# EAGLE design joulethief (EAGLE 6.4)
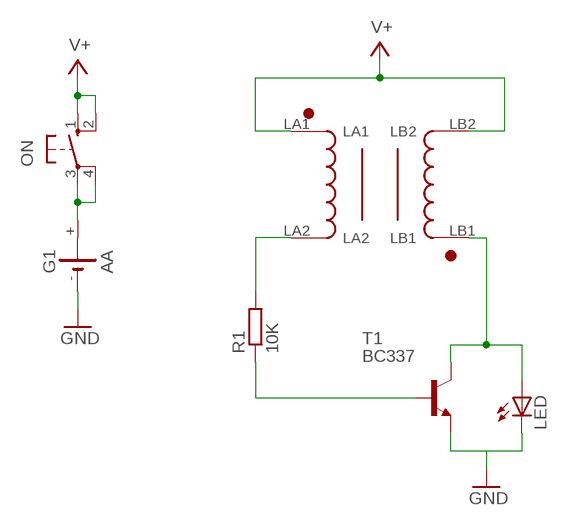
[diagram p0: schematic, sheet 1]

## Parts
G1  AA  [AA-HOLDER]
LED  LED5MM  [LED5MM]
ON  10-XX  [B3F-10XX]
R1  10K  R-EU_0207/10  [0207/10]
T1  BC337  [TO92]
U$1  COIL-BEAD  [BEAD-22-13.8-6.4]

## Nets
GND: G1.- LED.K(C) T1.1(E)
N$1: G1.+ ON.3(P) ON.4(P1)
N$2: R1.2 U$1.LA2
N$3: R1.1 T1.2(B)
N$5: LED.A T1.3(C) U$1.LB1
V+: ON.1(S) ON.2(S1) U$1.LA1 U$1.LB2

## Library data of the parts
G1 = tetalab:AA: AA Holder Eagle plastic devices
LED = led:LED: LED OSRAM: - CHIPLED LG R971, LG N971, LY N971, LG Q971, LY Q971, LO R971, LY R971 LH N974, LH R974 LS Q976, LO Q976, LY Q976 LO Q996 - Hyper CHIPLED LW Q18S LB Q993, LB Q99A, LB R99A - SideLED LS A670, LO A670, LY A670, LG A670, LP A670 LB A673, LV A673, LT A673, LW A673 LH A674 LY A675 LS A676, LA A676, LO A676, LY A676, LW A676 LS A679, LY A679, LG A679 - Hyper Micro SIDELED® LS Y876, LA Y876, LO Y876, LY Y876 LT Y87S - SmartLED LW L88C, LW L88S LB L89C, LB L89S, LG L890 LS L89K, LO L89K, LY L89K LS L896, LA L896, LO L896, LY L896 - TOPLED LS T670, LO T670, LY T670, LG T670, LP T670 LSG T670, LSP T670, LSY T670, LOP T670, LYG T670 LG T671, LOG T671, LSG T671 LB T673, LV T673, LT T673, LW T673 LH T674 LS T676, LA T676, LO T676, LY T676, LB T676, LH T676, LSB T676, LW T676 LB T67C, LV T67C, LT T67C, LS T67K, LO T67K, LY T67K, LW E67C LS E67B, LA E67B, LO E67B, LY E67B, LB E67C, LV E67C, LT E67C LW T67C LS T679, LY T679, LG T679 LS T770, LO T770, LY T770, LG T770, LP T770 LB T773, LV T773, LT T773, LW T773 LH T774 LS E675, LA E675, LY E675, LS T675 LS T776, LA T776, LO T776, LY T776, LB T776 LHGB T686 LT T68C, LB T68C - Hyper Mini TOPLED® LB M676 - Mini TOPLED Santana® LG M470 LS M47K, LO M47K, LY M47K Source: http://www.osram.convergy.de LUXEON: - LUMILED® LXK2-PW12-R00, LXK2-PW12-S00, LXK2-PW14-U00, LXK2-PW14-V00 LXK2-PM12-R00, LXK2-PM12-S00, LXK2-PM14-U00 LXK2-PE12-Q00, LXK2-PE12-R00, LXK2-PE12-S00, LXK2-PE14-T00, LXK2-PE14-U00 LXK2-PB12-K00, LXK2-PB12-L00, LXK2-PB12-M00, LXK2-PB14-N00, LXK2-PB14-P00, LXK2-PB14-Q00 LXK2-PR12-L00, LXK2-PR12-M00, LXK2-PR14-Q00, LXK2-PR14-R00 LXK2-PD12-Q00, LXK2-PD12-R00, LXK2-PD12-S00 LXK2-PH12-R00, LXK2-PH12-S00 LXK2-PL12-P00, LXK2-PL12-Q00, LXK2-PL12-R00 Source: www.luxeon.com KINGBRIGHT: KA-3528ASYC Source: www.kingbright.com
ON = switch-omron:10-XX: OMRON SWITCH; MPN: B3F-1000; OC_FARNELL: 176432; OC_NEWARK: 36M3542
R1 = rcl:R-EU_: RESISTOR, European symbol
T1 = transistor:BC337: NPN TRANSISTOR
U$1 = tetalab:COIL-BEAD

## Board
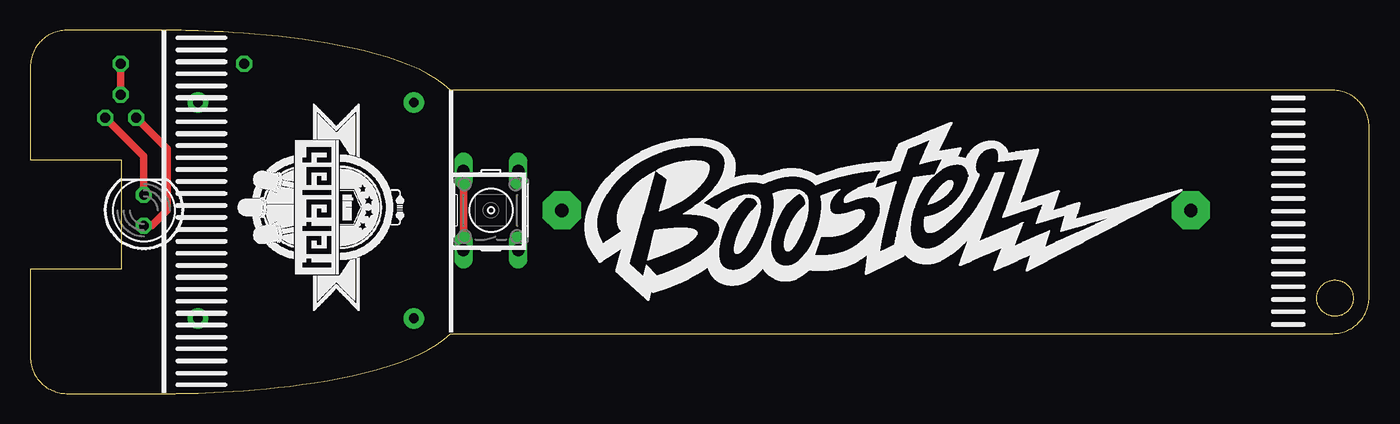
[diagram p1: board, top side]
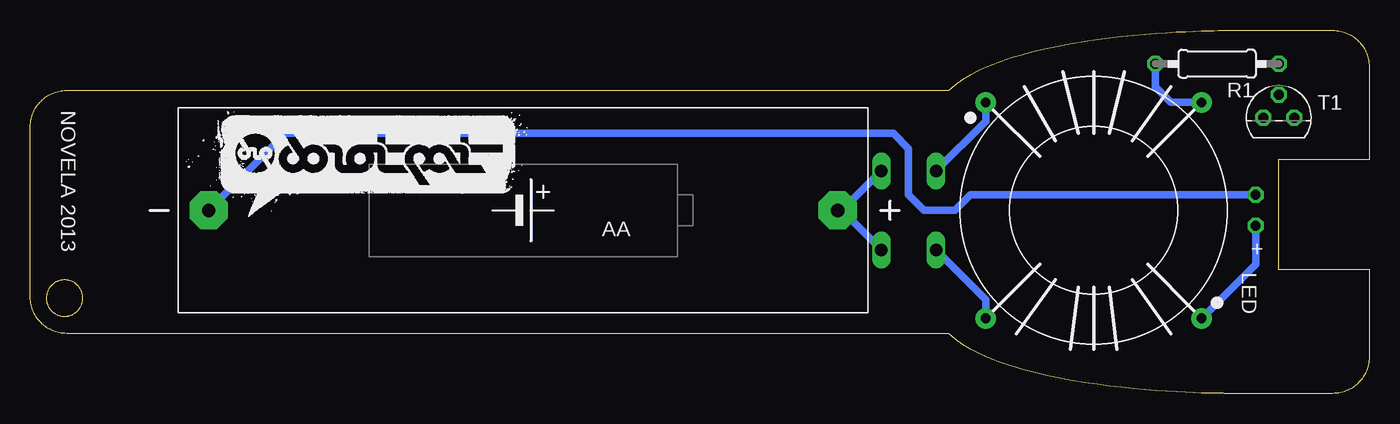
[diagram p2: board, bottom side, seen from below]

Size 110.26 x 29.9 mm. Coordinates in mm from the lower left corner, seen from the top.
Outline: 107.44,6.35 107.36,6.35 107.28,6.36 107.2,6.37 107.12,6.38 107.04,6.4 106.97,6.42 106.89,6.45 106.82,6.48 106.75,6.52 106.68,6.55 106.62,6.59 106.56,6.64 106.49,6.68 106.44,6.73 106.38,6.79 106.33,6.84 106.28,6.9 106.23,6.96 106.19,7.03 106.15,7.09 106.11,7.16 106.07,7.23 106.04,7.3 106.02,7.37 105.99,7.45 105.98,7.53 105.96,7.61 105.95,7.69 105.94,7.77 105.94,7.85 105.94,7.93 105.95,8.01 105.96,8.09 105.98,8.17 105.99,8.25 106.02,8.32 106.04,8.4 106.07,8.47 106.11,8.54 106.15,8.61 106.19,8.67 106.23,8.74 106.28,8.8 106.33,8.86 106.38,8.91 106.44,8.96 106.49,9.01 106.56,9.06 106.62,9.11 106.68,9.15 106.75,9.18 106.82,9.22 106.89,9.25 106.97,9.27 107.04,9.3 107.12,9.32 107.2,9.33 107.28,9.34 107.36,9.35 107.44,9.35 107.53,9.35 107.61,9.34 107.69,9.33 107.76,9.32 107.84,9.3 107.92,9.27 107.99,9.25 108.06,9.22 108.13,9.18 108.2,9.15 108.27,9.11 108.33,9.06 108.39,9.01 108.45,8.96 108.5,8.91 108.56,8.86 108.61,8.8 108.65,8.74 108.7,8.67 108.74,8.61 108.78,8.54 108.81,8.47 108.84,8.4 108.87,8.32 108.89,8.25 108.91,8.17 108.92,8.09 108.94,8.01 108.94,7.93 108.94,7.85 108.94,7.77 108.94,7.69 108.92,7.61 108.91,7.53 108.89,7.45 108.87,7.37 108.84,7.3 108.81,7.23 108.78,7.16 108.74,7.09 108.7,7.03 108.65,6.96 108.61,6.9 108.56,6.84 108.5,6.79 108.45,6.73 108.39,6.68 108.33,6.64 108.27,6.59 108.2,6.55 108.13,6.52 108.06,6.48 107.99,6.45 107.92,6.42 107.84,6.4 107.76,6.38 107.69,6.37 107.61,6.36 107.53,6.35 107.44,6.35
Outline: 34.63,24.96 34.08,25.44 33.45,25.88 32.76,26.3 32,26.68 31.19,27.04 30.32,27.37 29.42,27.67 28.47,27.95 27.49,28.2 26.5,28.43 25.48,28.64 24.45,28.83 23.43,29 22.4,29.15 21.39,29.28 20.39,29.39 19.41,29.49 18.47,29.58 17.56,29.65 16.7,29.71 15.88,29.76 15.13,29.8 14.44,29.83 13.81,29.86 13.27,29.87 12.81,29.88 12.44,29.89 12.17,29.9 12,29.9 11.94,29.9 3,29.9 2.84,29.89 2.68,29.88 2.52,29.86 2.36,29.83 2.21,29.79 2.06,29.74 1.91,29.69 1.77,29.63 1.63,29.56 1.49,29.49 1.36,29.4 1.23,29.32 1.11,29.22 0.99,29.12 0.88,29.01 0.78,28.9 0.68,28.79 0.58,28.66 0.49,28.54 0.41,28.41 0.34,28.27 0.27,28.13 0.21,27.99 0.15,27.84 0.11,27.69 0.07,27.54 0.04,27.38 0.02,27.22 0,27.06 0,26.89 0,19.23 7.47,19.23 7.47,10.22 0,10.22 0,3 0,2.84 0.02,2.68 0.04,2.52 0.07,2.36 0.11,2.21 0.15,2.06 0.21,1.91 0.27,1.77 0.34,1.63 0.41,1.49 0.49,1.36 0.58,1.23 0.68,1.11 0.78,0.99 0.88,0.88 0.99,0.78 1.11,0.68 1.23,0.58 1.36,0.49 1.49,0.41 1.63,0.34 1.77,0.27 1.91,0.21 2.06,0.15 2.21,0.11 2.36,0.07 2.52,0.04 2.68,0.02 2.84,0 3,0 11.94,0 12,0 12.17,0 12.44,0.01 12.81,0.01 13.27,0.02 13.81,0.04 14.44,0.06 15.13,0.09 15.88,0.13 16.7,0.18 17.56,0.24 18.47,0.32 19.41,0.4 20.39,0.5 21.39,0.62 22.4,0.75 23.43,0.9 24.45,1.07 25.48,1.25 26.5,1.46 27.49,1.69 28.47,1.95 29.42,2.23 30.32,2.53 31.19,2.86 32,3.21 32.76,3.6 33.45,4.02 34.08,4.46 34.63,4.94 107.26,4.94 107.42,4.94 107.58,4.96 107.74,4.98 107.9,5.01 108.05,5.05 108.2,5.09 108.35,5.15 108.49,5.21 108.63,5.27 108.77,5.35 108.9,5.43 109.03,5.52 109.15,5.61 109.27,5.71 109.38,5.82 109.48,5.93 109.58,6.05 109.68,6.17 109.77,6.3 109.85,6.43 109.92,6.56 109.99,6.7 110.05,6.85 110.11,6.99 110.15,7.15 110.19,7.3 110.22,7.46 110.24,7.62 110.26,7.78 110.26,7.94 110.26,21.96 110.26,22.12 110.24,22.28 110.22,22.44 110.19,22.6 110.15,22.75 110.11,22.9 110.05,23.05 109.99,23.19 109.92,23.33 109.85,23.47 109.77,23.6 109.68,23.73 109.58,23.85 109.48,23.96 109.38,24.08 109.27,24.18 109.15,24.28 109.03,24.38 108.9,24.47 108.77,24.55 108.63,24.62 108.49,24.69 108.35,24.75 108.2,24.8 108.05,24.85 107.9,24.89 107.74,24.92 107.58,24.94 107.42,24.95 107.26,24.96 34.63,24.96
Copper layers (1*16): Top 0.035mm / dielectric 1.5mm / Bottom 0.035mm
Design rules "default": minimum track width 10mil, minimum drill 24mil, track to track 8mil, track to pad 8mil, pad to pad 8mil, via to via 8mil, smd to smd 8mil, copper to edge 40mil, drill to drill 8mil, minimum pad ring 10mil, minimum via ring 8mil, stop-mask expansion 4mil, vias tented up to drill 0mil, thermal gap 10mil

### Footprints (pad centres in the part's own frame; a part is rotated, then mirrored left to right if it is on the bottom)
AA-HOLDER = drill 1.1 pad 3.15 octagon: + 25.9,0; - -25.9,0
LED5MM = drill 0.813 octagon: A -1.27,0; K 1.27,0
B3F-10XX = drill 1.016 long: 1 -3.251,2.261; 2 3.251,2.261; 3 -3.251,-2.261; 4 3.251,-2.261
0207/10 = drill 0.813 octagon: 1 -5.08,0; 2 5.08,0
TO92 = drill 0.813 octagon: 1 1.27,0; 2 0,1.905; 3 -1.27,0
BEAD-22-13.8-6.4 = drill 0.8 pad 1.676: LA1 -8.89,8.89; LA2 8.89,8.89; LB1 8.89,-8.89; LB2 -8.89,-8.89

### Placement (x,y rotation side)
G1  69.68,15.08 0 bottom
LED  9.35,15.08 90 top
ON  37.93,15.08 90 top
R1  12.53,27.14 180 bottom
T1  7.45,22.7 0 bottom
U$1  22.69,15.08 0 bottom

### Tracks (layer width: path | path; a pad name or v marks a point on that pad's centre or on a via)
GND
  Top 0.61: T1.1 9.35,19.52 LED.K
  Bottom 0.61: G1.- 89.23,21.43 39.2,21.43 37.93,20.16 37.93,16.35 36.66,15.08 34.12,15.08 32.85,16.35 LED.K
N$1
  Bottom 0.61: ON.4 43.22,15.29 | 43.22,15.29 43.44,15.08 G1.+ | ON.3 43.22,14.86 43.22,15.29
N$2
  Bottom 0.61: R1.2 17.61,25.24 16.34,23.97 U$1.LA2
N$3
  Top 0.61: R1.1 T1.2
N$5
  Top 0.61: T1.3 11.26,20.16 11.26,15.08 9.99,13.81 LED.A
  Bottom 0.61: U$1.LB1 9.35,10.63 LED.A
V+
  Top 0.61: ON.2 ON.1
  Bottom 0.61: U$1.LA1 31.58,22.42 ON.2 | ON.1 31.58,7.74 U$1.LB2

### Text on the board
bPlace: NOVELA 2013 | +